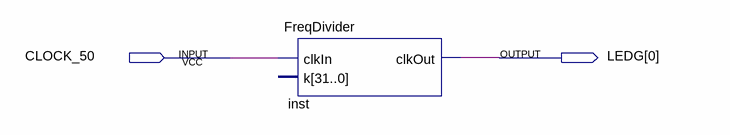
[diagram p0: schematic sheet]
// Quartus schematic FreqDivider_Demo.bdf as structural Verilog: 1 symbols, 2 pins
module FreqDivider_Demo (
  input  CLOCK_50,
  output [0:0] LEDG
);

  FreqDivider inst (.clkIn(CLOCK_50), .clkOut(LEDG[0]));  // open: k
endmodule
